# Altium schematic sheet Output.SchDoc
size A; SheetNumber: 3; SheetTotal: 4
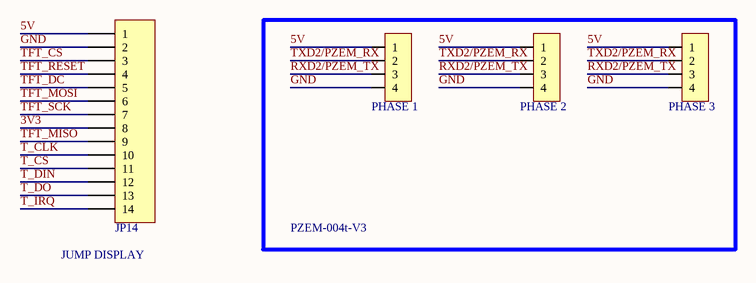
[diagram p0: Output.SchDoc]

## Parts
DISPLAY  JP14  [JP14-D1T]
PHASE_1  PHASE 1  [JP4-C1T]
PHASE_2  PHASE 2  [JP4-C1T]
PHASE_3  PHASE 3  [JP4-C1T]

## Blocks framed on the sheet
PZEM-004t-V3: PHASE_1-PHASE_3

## Nets
3V3: DISPLAY.8
5V: DISPLAY.1 PHASE_1.1 PHASE_2.1 PHASE_3.1
GND: DISPLAY.2 PHASE_1.4 PHASE_2.4 PHASE_3.4
RXD2/PZEM_TX: PHASE_1.3 PHASE_2.3 PHASE_3.3
T_CLK: DISPLAY.10
T_CS: DISPLAY.11
T_DIN: DISPLAY.12
T_DO: DISPLAY.13
T_IRQ: DISPLAY.14
TFT_CS: DISPLAY.3
TFT_DC: DISPLAY.5
TFT_MISO: DISPLAY.9
TFT_MOSI: DISPLAY.6
TFT_RESET: DISPLAY.4
TFT_SCK: DISPLAY.7
TXD2/PZEM_RX: PHASE_1.2 PHASE_2.2 PHASE_3.2

## Notes on the sheet
- (near DISPLAY) JUMP DISPLAY

## Library data of the parts
DISPLAY = JP14: WR-PHD 2.54 mm Angled Socket Header; Manufacturer: W¨¹rth Elektronik eiSos GmbH; partNo: 613014143121; ComponentLink1 Description: Manufacturer; ComponentLink2 Description: Datasheet; NoPins: 14; Created Date: 29 March 2013; ComponentLink1URL: http://www.we-online.com; ComponentLink2URL: http://katalog.we-online.de/em/datasheet/6130xx143121.pdf; Created by: Karrer Zheng
PHASE_1-PHASE_3 = JP4: WR-PHD 2.54 mm Angled Socket Header; Manufacturer: W¨¹rth Elektronik eiSos GmbH; partNo: 613004143121; ComponentLink1 Description: Manufacturer; ComponentLink2 Description: Datasheet; NoPins: 04; Created Date: 29 March 2013; ComponentLink1URL: http://www.we-online.com; ComponentLink2URL: http://katalog.we-online.de/em/datasheet/6130xx143121.pdf; Created by: Karrer Zheng